# EAGLE design Memory Board (EAGLE 6.5.0)
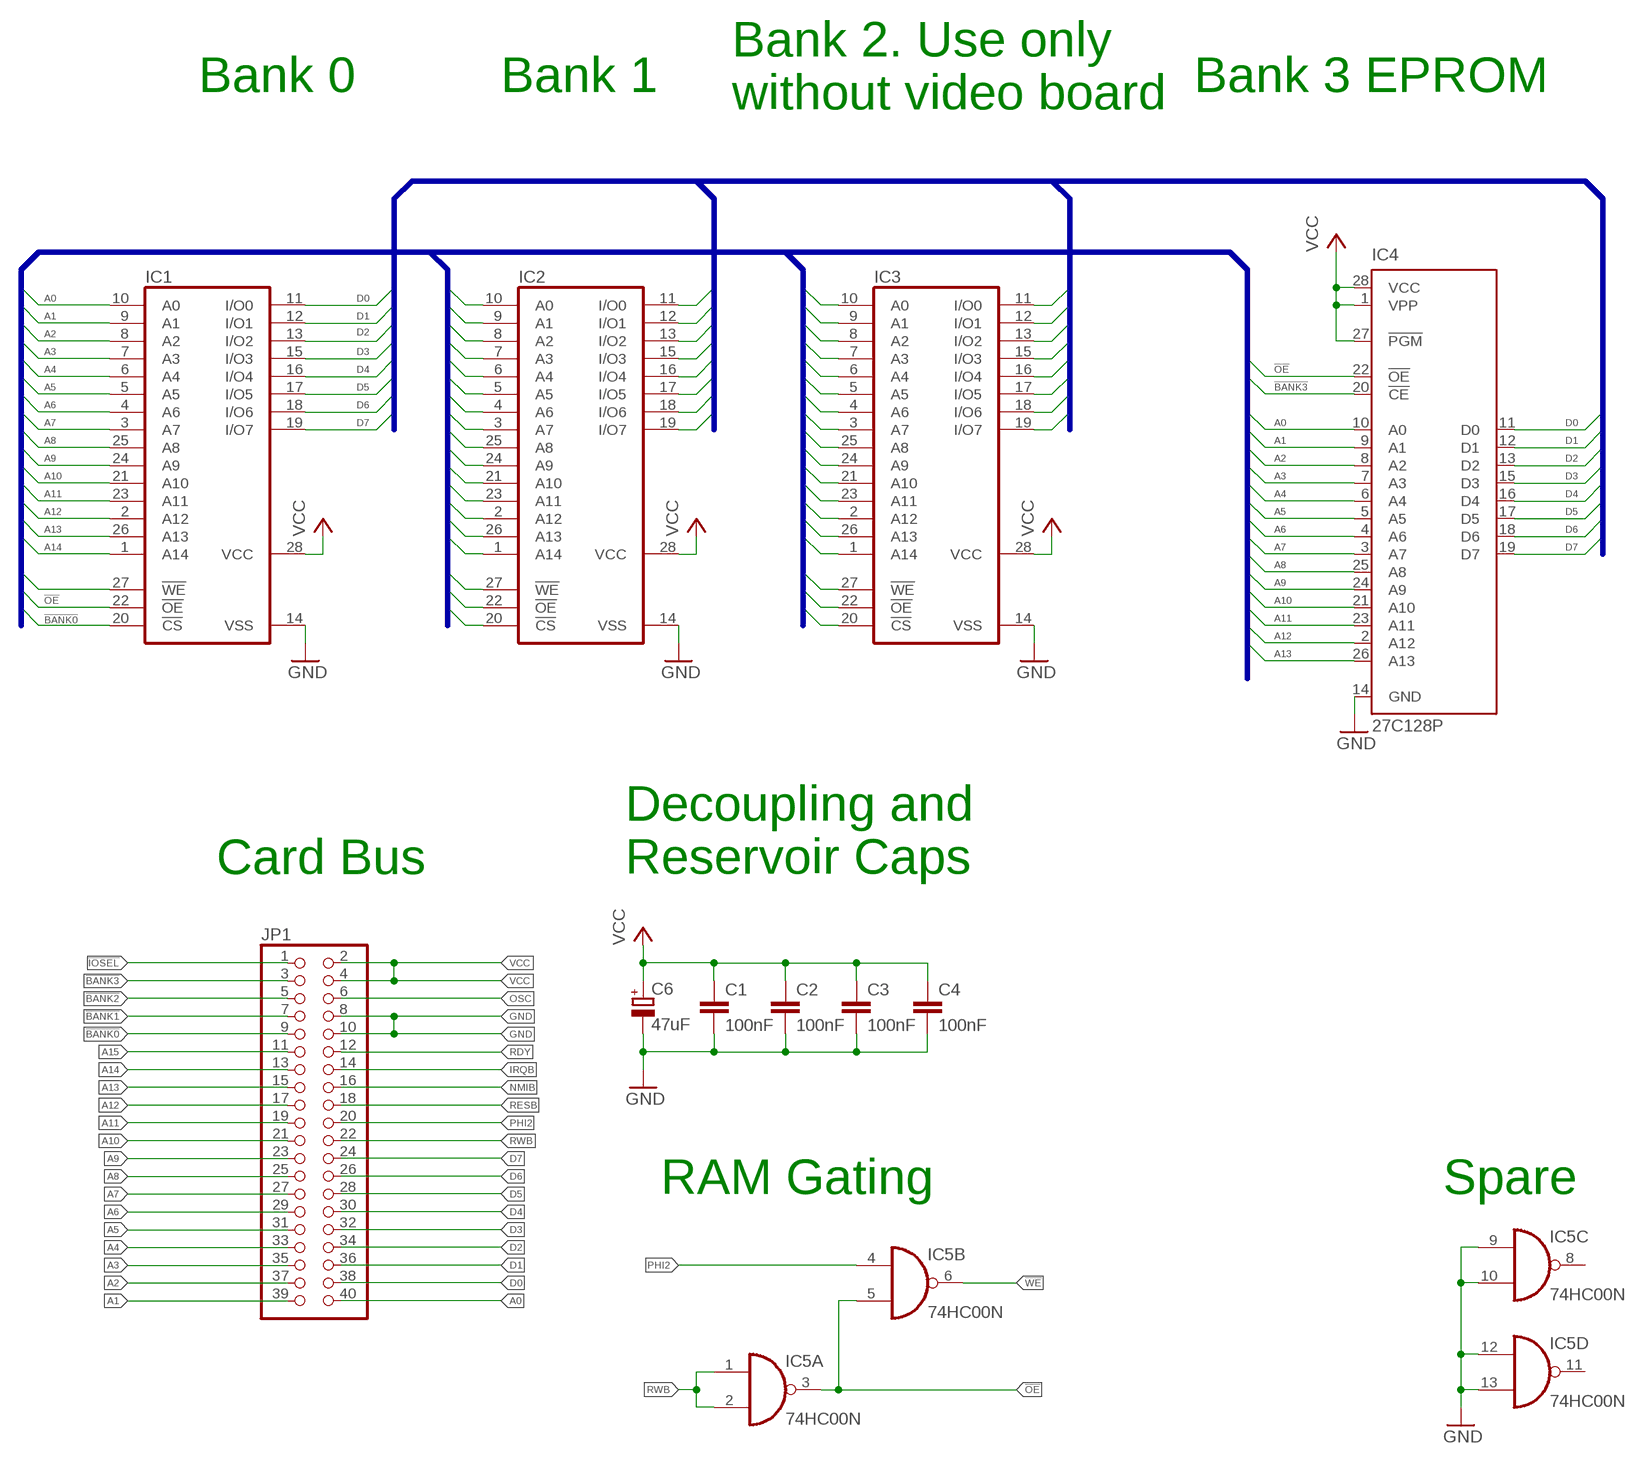
[diagram p0: schematic, sheet 1]

## Parts
C1  100nF  C-EU050-025X075  [C050-025X075]
C2  100nF  C-EU050-025X075  [C050-025X075]
C3  100nF  C-EU050-025X075  [C050-025X075]
C4  100nF  C-EU050-025X075  [C050-025X075]
C6  47uF  CPOL-EUE2.5-7  [E2,5-7]
IC1  62256P  [DIL28-6]
IC2  62256P  [DIL28-6]
IC3  62256P  [DIL28-6]
IC4  27C128P  [DIL28-6]
IC5  74HC00N  [DIL14]
JP1  PINHD-2X20/90  [2X20/90]

## Nets
!BANK0: IC1.20(!CS) JP1.9
!BANK1: IC2.20(!CS) JP1.7
!BANK2: IC3.20(!CS) JP1.5
!BANK3: IC4.20(!CE) JP1.3
!IOSEL: JP1.1
!OE: IC1.22(!OE) IC2.22(!OE) IC3.22(!OE) IC4.22(!OE) IC5.3(A:O) IC5.5(B:I1)
!WE: IC1.27(!WE) IC2.27(!WE) IC3.27(!WE) IC5.6(B:O)
A0: IC1.10(A0) IC2.10(A0) IC3.10(A0) IC4.10(A0) JP1.40
A1: IC1.9(A1) IC2.9(A1) IC3.9(A1) IC4.9(A1) JP1.39
A2: IC1.8(A2) IC2.8(A2) IC3.8(A2) IC4.8(A2) JP1.37
A3: IC1.7(A3) IC2.7(A3) IC3.7(A3) IC4.7(A3) JP1.35
A4: IC1.6(A4) IC2.6(A4) IC3.6(A4) IC4.6(A4) JP1.33
A5: IC1.5(A5) IC2.5(A5) IC3.5(A5) IC4.5(A5) JP1.31
A6: IC1.4(A6) IC2.4(A6) IC3.4(A6) IC4.4(A6) JP1.29
A7: IC1.3(A7) IC2.3(A7) IC3.3(A7) IC4.3(A7) JP1.27
A8: IC1.25(A8) IC2.25(A8) IC3.25(A8) IC4.25(A8) JP1.25
A9: IC1.24(A9) IC2.24(A9) IC3.24(A9) IC4.24(A9) JP1.23
A10: IC1.21(A10) IC2.21(A10) IC3.21(A10) IC4.21(A10) JP1.21
A11: IC1.23(A11) IC2.23(A11) IC3.23(A11) IC4.23(A11) JP1.19
A12: IC1.2(A12) IC2.2(A12) IC3.2(A12) IC4.2(A12) JP1.17
A13: IC1.26(A13) IC2.26(A13) IC3.26(A13) IC4.26(A13) JP1.15
A14: IC1.1(A14) IC2.1(A14) IC3.1(A14) JP1.13
A15: JP1.11
D0: IC1.11(I/O0) IC2.11(I/O0) IC3.11(I/O0) IC4.11(D0) JP1.38
D1: IC1.12(I/O1) IC2.12(I/O1) IC3.12(I/O1) IC4.12(D1) JP1.36
D2: IC1.13(I/O2) IC2.13(I/O2) IC3.13(I/O2) IC4.13(D2) JP1.34
D3: IC1.15(I/O3) IC2.15(I/O3) IC3.15(I/O3) IC4.15(D3) JP1.32
D4: IC1.16(I/O4) IC2.16(I/O4) IC3.16(I/O4) IC4.16(D4) JP1.30
D5: IC1.17(I/O5) IC2.17(I/O5) IC3.17(I/O5) IC4.17(D5) JP1.28
D6: IC1.18(I/O6) IC2.18(I/O6) IC3.18(I/O6) IC4.18(D6) JP1.26
D7: IC1.19(I/O7) IC2.19(I/O7) IC3.19(I/O7) IC4.19(D7) JP1.24
GND: C1.2 C2.2 C3.2 C4.2 C6.- IC1.14(VSS) IC2.14(VSS) IC3.14(VSS) IC4.14(GND) IC5.9(C:I0) IC5.10(C:I1) IC5.12(D:I0) IC5.13(D:I1) JP1.8 JP1.10
IRQB: JP1.14
NMIB: JP1.16
OSC: JP1.6
PHI2: IC5.4(B:I0) JP1.20
RDY: JP1.12
RESB: JP1.18
RWB: IC5.1(A:I0) IC5.2(A:I1) JP1.22
VCC: C1.1 C2.1 C3.1 C4.1 C6.+ IC1.28(VCC) IC2.28(VCC) IC3.28(VCC) IC4.1(VPP) IC4.27(!PGM) IC4.28(VCC) JP1.2 JP1.4
Unconnected: IC5.8(C:O) IC5.11(D:O)

## Buses
D[0..7]
A[0..15],!OE,!BANK0,!BANK1,!BANK2,!BANK3,!WE

## Notes on the sheet
- Bank 0 | Bank 1 | Bank 3 EPROM
- Bank 2. Use only
  without video board
- Card Bus
- Decoupling and
  Reservoir Caps
- RAM Gating | Spare

## Power pins joined to a net without a drawn wire
GND: IC5.7(P:GND)
VCC: IC5.14(P:VCC)

## Library data of the parts
C1-C4 = rcl:C-EU: CAPACITOR, European symbol
C6 = rcl:CPOL-EU: POLARIZED CAPACITOR, European symbol
IC1-IC3 = memory-hitachi:62256P: MEMORY; OC_FARNELL: unknown; OC_NEWARK: unknown
IC4 = microchip:27*128: CMOS EPROM 128 K (16 K x 8); OC_FARNELL: unknown; OC_NEWARK: unknown
IC5 = 74xx-eu:74*00: Quad 2-input NAND gate
JP1 = pinhead:PINHD-2X20: PIN HEADER

## Board
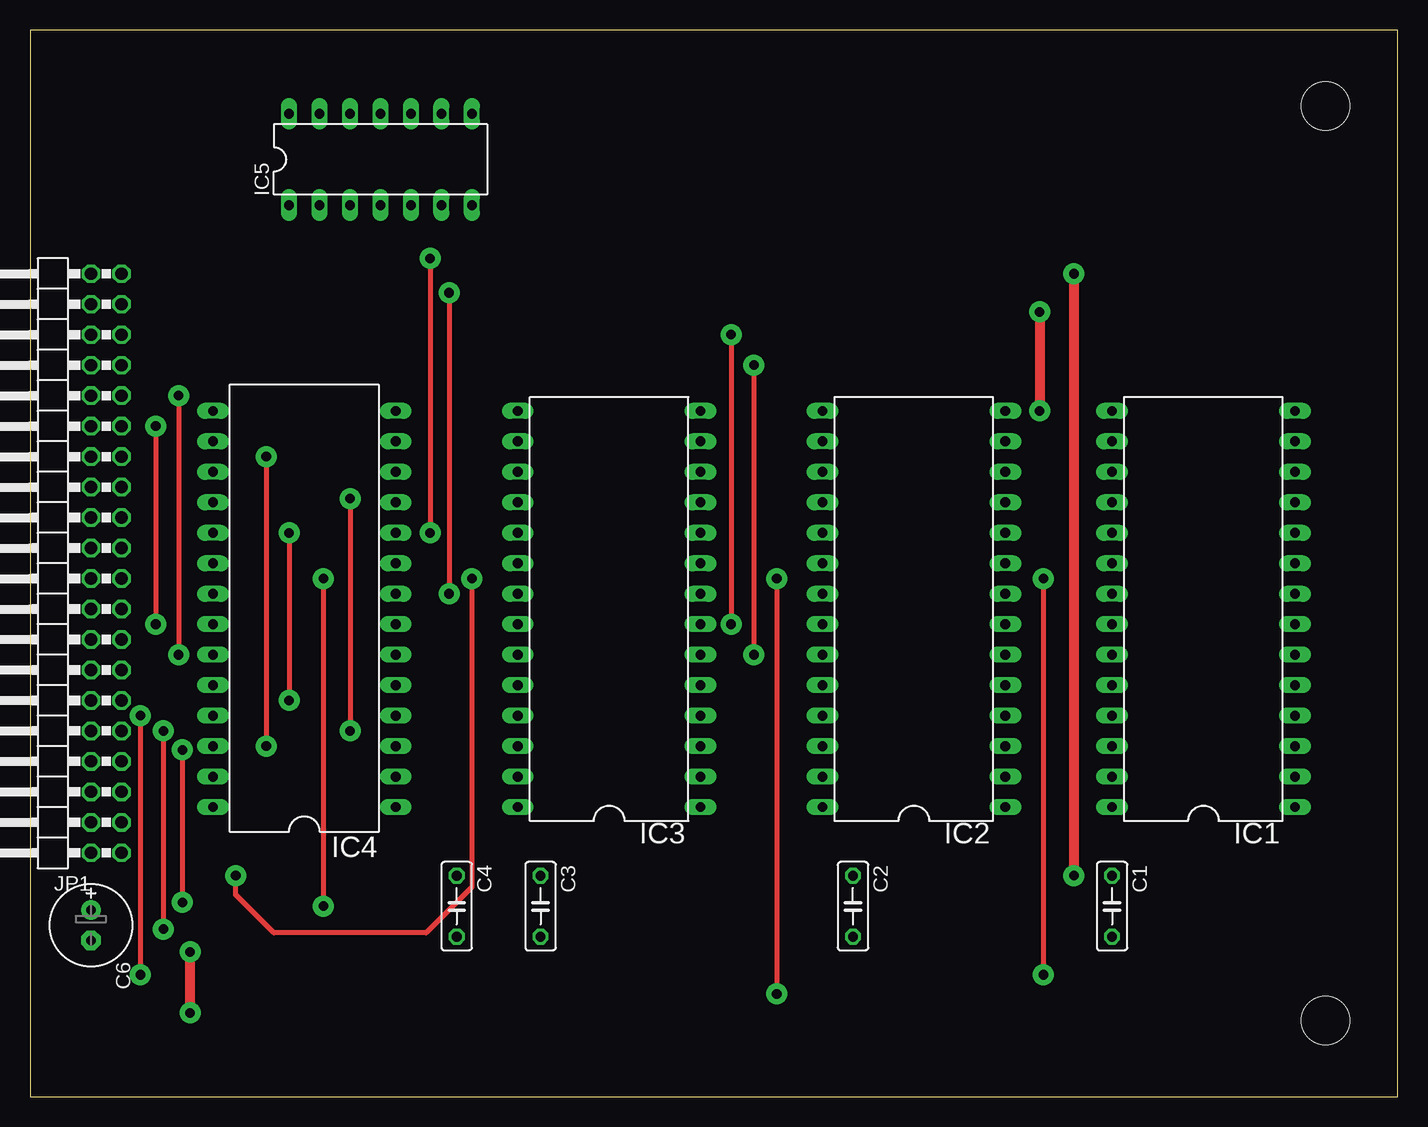
[diagram p1: board, top side]
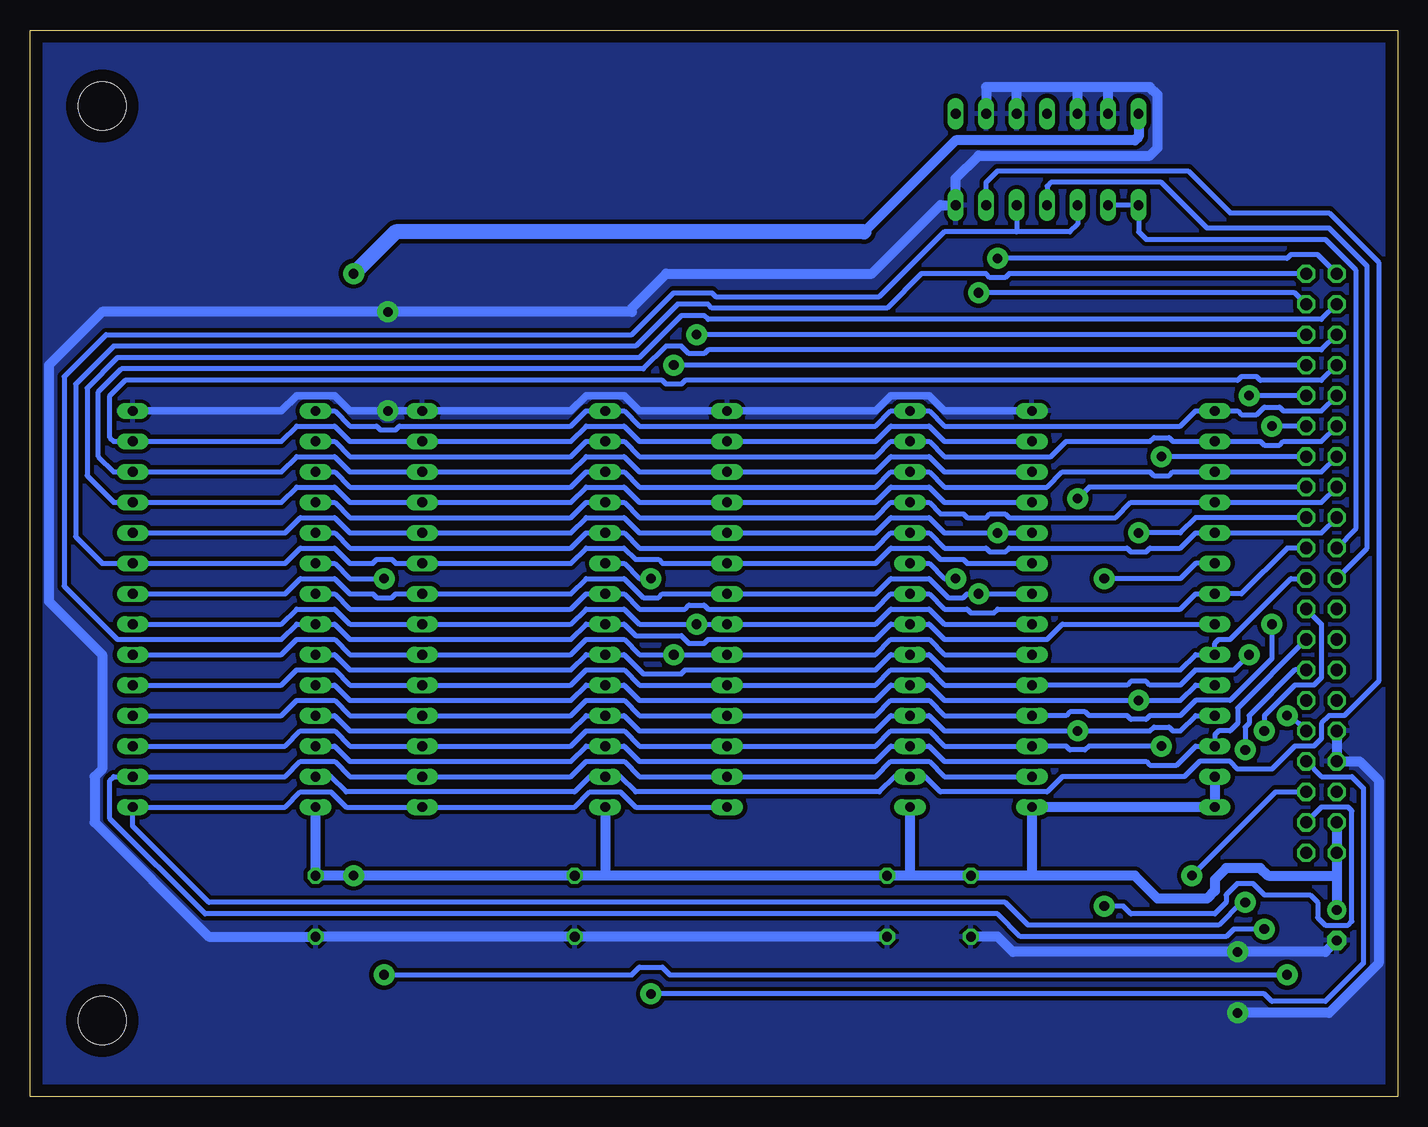
[diagram p2: board, bottom side, seen from below]

Size 113.97 x 88.89 mm. Coordinates in mm from the lower left corner, seen from the top.
Outline: 0,0 113.97,0 113.97,88.89 0,88.89 0,0
Copper layers (1*16): Top 0.035mm / dielectric 1.5mm / Bottom 0.035mm
Design rules "default *": minimum track width 10mil, minimum drill 24mil, track to track 8mil, track to pad 8mil, pad to pad 8mil, via to via 8mil, smd to smd 8mil, copper to edge 40mil, drill to drill 8mil, minimum pad ring 10mil, minimum via ring 8mil, stop-mask expansion 4mil, vias tented up to drill 0mil, thermal gap 12mil
Holes 4 mm at 107.95,82.55 107.95,6.35

### Footprints (pad centres in the part's own frame; a part is rotated, then mirrored left to right if it is on the bottom)
C050-025X075 = drill 0.813 octagon: 1 -2.54,0; 2 2.54,0
E2,5-7 = drill 0.813 pad 1.6: + -1.27,0 | drill 0.813 pad 1.6 octagon: - 1.27,0
DIL28-6 = drill 0.813 long: 1 -16.51,-7.62; 2 -13.97,-7.62; 3 -11.43,-7.62; 4 -8.89,-7.62; 5 -6.35,-7.62; 6 -3.81,-7.62; 7 -1.27,-7.62; 8 1.27,-7.62; 9 3.81,-7.62; 10 6.35,-7.62; 11 8.89,-7.62; 12 11.43,-7.62; 13 13.97,-7.62; 14 16.51,-7.62; 15 16.51,7.62; 16 13.97,7.62; 17 11.43,7.62; 18 8.89,7.62; 19 6.35,7.62; 20 3.81,7.62; 21 1.27,7.62; 22 -1.27,7.62; 23 -3.81,7.62; 24 -6.35,7.62; 25 -8.89,7.62; 26 -11.43,7.62; 27 -13.97,7.62; 28 -16.51,7.62
DIL14 = drill 0.813 long: 1 -7.62,-3.81; 2 -5.08,-3.81; 3 -2.54,-3.81; 4 0,-3.81; 5 2.54,-3.81; 6 5.08,-3.81; 7 7.62,-3.81; 8 7.62,3.81; 9 5.08,3.81; 10 2.54,3.81; 11 0,3.81; 12 -2.54,3.81; 13 -5.08,3.81; 14 -7.62,3.81
2X20/90 = drill 1.016 octagon: 1 -24.13,-6.35; 2 -24.13,-3.81; 3 -21.59,-6.35; 4 -21.59,-3.81; 5 -19.05,-6.35; 6 -19.05,-3.81; 7 -16.51,-6.35; 8 -16.51,-3.81; 9 -13.97,-6.35; 10 -13.97,-3.81; 11 -11.43,-6.35; 12 -11.43,-3.81; 13 -8.89,-6.35; 14 -8.89,-3.81; 15 -6.35,-6.35; 16 -6.35,-3.81; 17 -3.81,-6.35; 18 -3.81,-3.81; 19 -1.27,-6.35; 20 -1.27,-3.81; 21 1.27,-6.35; 22 1.27,-3.81; 23 3.81,-6.35; 24 3.81,-3.81; 25 6.35,-6.35; 26 6.35,-3.81; 27 8.89,-6.35; 28 8.89,-3.81; 29 11.43,-6.35; 30 11.43,-3.81; 31 13.97,-6.35; 32 13.97,-3.81; 33 16.51,-6.35; 34 16.51,-3.81; 35 19.05,-6.35; 36 19.05,-3.81; 37 21.59,-6.35; 38 21.59,-3.81; 39 24.13,-6.35; 40 24.13,-3.81

### Placement (x,y rotation side)
C1  90.17,15.88 270 top
C2  68.58,15.88 270 top
C3  42.55,15.88 270 top
C4  35.56,15.88 270 top
C6  5.08,14.29 270 top
IC1  97.79,40.64 90 top
IC2  73.66,40.64 90 top
IC3  48.26,40.64 90 top
IC4  22.86,40.64 90 top
IC5  29.21,78.11 0 top
JP1  1.27,44.45 90 top

### Tracks (layer width: path | path; a pad name or v marks a point on that pad's centre or on a via)
!BANK0  (via drill 0.8 pad 1.75)
  Top 0.406: v9.21,31.75 v9.21,10.16 | v84.45,43.18 v84.45,10.16
  Bottom 0.406: JP1.9 8.26,31.11 v9.21,31.75 | IC1.20 88.58,44.45 87.31,43.18 v84.45,43.18 | v84.45,10.16 63.82,10.16 63.18,10.79 61.28,10.79 60.64,10.16 v9.21,10.16
!BANK1  (via drill 0.8 pad 1.75)
  Top 0.406: v62.23,43.18 v62.23,8.57
  Bottom 0.406: IC2.20 64.45,44.45 63.18,43.18 v62.23,43.18 | JP1.7 6.35,26.67 3.81,26.67 2.86,25.72 2.86,11.11 6.03,7.94 10.48,7.94 11.11,8.57 v62.23,8.57
!BANK2  (via drill 0.8 pad 1.75)
  Top 0.406: v36.83,43.18 36.83,17.46 33.02,13.65 20.32,13.65 17.14,16.83 v17.14,18.41
  Bottom 0.406: v36.83,43.18 37.78,43.18 39.05,44.45 IC3.20 | v17.14,18.41 10.16,25.4 JP1.5
!BANK3  (via drill 0.8 pad 1.75)
  Top 0.406: v24.45,43.18 v24.45,15.88
  Bottom 0.406: IC4.20 16.83,44.45 18.1,43.18 v24.45,43.18 | JP1.3 6.35,24.13 4.13,24.13 3.81,23.81 3.81,14.61 4.13,14.29 6.03,14.29 6.67,14.92 6.67,16.19 7.3,16.83 11.11,16.83 12.06,17.78 13.34,17.78 14.29,16.83 14.29,16.19 15.24,15.24 22.23,15.24 22.86,15.88 v24.45,15.88
!OE
  Bottom 0.406: IC4.22 27.94,39.37 29.21,38.1 37.78,38.1 39.05,39.37 IC3.22 42.23,39.37 43.5,38.1 57.47,38.1 57.78,37.78 59.05,37.78 59.69,38.42 63.5,38.42 64.45,39.37 IC2.22 67.63,39.37 68.9,38.1 87.31,38.1 88.58,39.37 IC1.22 91.76,39.37 93.03,38.1 106.68,38.1 111.12,42.55 111.12,60.01 107.63,63.5 63.82,63.5 60.33,66.99 57.15,66.99 56.83,66.67 43.18,66.67 37.78,72.07 31.75,72.07 | IC5.3 26.67,72.71 27.3,72.07 31.75,72.07 | IC5.5 31.75,72.07
!WE
  Bottom 0.406: IC1.27 88.9,26.67 87.63,25.4 68.58,25.4 67.31,26.67 IC2.27 64.77,26.67 63.5,25.4 43.18,25.4 41.91,26.67 IC3.27 39.37,26.67 38.1,25.4 29.21,25.4 27.94,26.67 17.78,26.67 16.51,27.94 13.97,27.94 13.34,27.3 10.48,27.3 8.57,29.21 6.99,29.21 6.35,29.84 6.35,31.11 5.71,31.75 4.45,31.75 1.59,34.61 1.59,69.53 5.71,73.66 13.97,73.66 17.46,77.15 33.34,77.15 34.29,76.2 IC5.6
A0  (via drill 0.8 pad 1.75)
  Top 0.406: v33.34,69.85 v33.34,46.99
  Bottom 0.406: IC1.10 92.71,46.99 91.44,48.26 88.58,48.26 87.31,46.99 IC2.10 68.9,46.99 67.63,48.26 64.45,48.26 63.18,46.99 IC3.10 43.5,46.99 42.23,48.26 39.05,48.26 37.78,46.99 v33.34,46.99 IC4.10 | JP1.40 6.67,70.17 8.89,70.17 9.21,69.85 v33.34,69.85
A1
  Bottom 0.406: IC4.9 35.88,44.45 36.2,44.77 38.1,44.77 39.05,45.72 42.23,45.72 43.5,44.45 IC3.9 61.28,44.45 61.59,44.77 63.5,44.77 64.45,45.72 67.63,45.72 68.9,44.45 IC2.9 83.5,44.45 83.82,44.77 85.09,44.77 85.41,44.45 87.31,44.45 88.58,45.72 91.44,45.72 92.71,44.45 IC1.9 107.95,44.45 110.17,46.67 110.17,59.37 107,62.55 63.5,62.55 60.01,66.04 57.47,66.04 57.15,65.72 42.55,65.72 39.69,68.58 34.29,68.58 33.97,68.26 32.7,68.26 32.38,68.58 JP1.39
A2  (via drill 0.8 pad 1.75)
  Top 0.406: v34.92,66.99 v34.92,41.91
  Bottom 0.406: IC1.8 92.71,41.91 91.44,43.18 88.58,43.18 87.31,41.91 85.41,41.91 85.09,41.59 83.82,41.59 83.5,41.91 IC2.8 68.9,41.91 67.63,43.18 64.45,43.18 62.87,41.59 61.59,41.59 61.28,41.91 IC3.8 43.5,41.91 42.23,43.18 39.05,43.18 37.47,41.59 36.2,41.59 35.88,41.91 v34.92,41.91 IC4.8 | JP1.37 8.57,66.99 v34.92,66.99
A3  (via drill 0.8 pad 1.75)
  Top 0.406: v58.42,63.5 v58.42,39.37
  Bottom 0.406: IC1.7 93.03,39.37 91.76,40.64 88.58,40.64 87.31,39.37 IC2.7 68.9,39.37 67.63,40.64 64.45,40.64 63.18,39.37 v58.42,39.37 IC3.7 43.5,39.37 42.23,40.64 39.05,40.64 37.78,39.37 IC4.7 | JP1.35 v58.42,63.5
A4  (via drill 0.8 pad 1.75)
  Top 0.406: v60.33,60.96 v60.33,36.83
  Bottom 0.406: IC1.6 93.03,36.83 91.76,38.1 88.58,38.1 87.31,36.83 IC2.6 68.9,36.83 67.63,38.1 64.45,38.1 63.18,36.83 v60.33,36.83 IC3.6 43.5,36.83 42.23,38.1 39.05,38.1 37.78,36.83 IC4.6 | JP1.33 v60.33,60.96
A5  (via drill 0.8 pad 1.75)
  Top 0.406: v12.38,58.42 v12.38,36.83
  Bottom 0.406: IC1.5 93.03,34.29 91.76,35.56 88.58,35.56 87.31,34.29 IC2.5 68.9,34.29 67.63,35.56 64.45,35.56 63.18,34.29 IC3.5 43.5,34.29 42.23,35.56 39.05,35.56 37.78,34.29 IC4.5 22.54,34.29 22.23,34.61 20.95,34.61 20.64,34.29 18.1,34.29 16.83,35.56 13.65,35.56 v12.38,36.83 | JP1.31 v12.38,58.42
A6  (via drill 0.8 pad 1.75)
  Top 0.406: v10.48,55.88 v10.48,39.37
  Bottom 0.406: IC1.4 93.03,31.75 91.76,33.02 88.58,33.02 87.31,31.75 IC2.4 68.9,31.75 67.63,33.02 64.45,33.02 63.18,31.75 IC3.4 43.5,31.75 42.23,33.02 39.05,33.02 37.78,31.75 IC4.4 27.62,31.75 27.3,32.07 26.04,32.07 25.72,31.75 22.54,31.75 22.23,31.43 20.95,31.43 20.64,31.75 18.1,31.75 16.83,33.02 13.97,33.02 10.48,36.51 v10.48,39.37 | JP1.29 v10.48,55.88
A7  (via drill 0.8 pad 1.75)
  Top 0.406: v19.68,53.34 v19.68,29.21
  Bottom 0.406: IC1.3 92.71,29.21 91.44,30.48 88.58,30.48 87.31,29.21 IC2.3 68.9,29.21 67.63,30.48 64.45,30.48 63.18,29.21 IC3.3 43.5,29.21 42.23,30.48 39.05,30.48 37.78,29.21 IC4.3 27.62,29.21 27.3,28.89 26.04,28.89 25.72,29.21 v19.68,29.21 | JP1.27 v19.68,53.34
A8  (via drill 0.8 pad 1.75)
  Top 0.406: v26.67,49.85 v26.67,30.48
  Bottom 0.406: IC1.25 88.58,31.75 87.31,30.48 68.9,30.48 67.63,31.75 IC2.25 64.45,31.75 63.18,30.48 43.5,30.48 42.23,31.75 IC3.25 39.05,31.75 37.78,30.48 v26.67,30.48 20.64,30.48 20.32,30.8 19.05,30.8 18.73,30.48 18.1,30.48 16.83,31.75 IC4.25 | JP1.25 25.72,50.8 v26.67,49.85
A9  (via drill 0.8 pad 1.75)
  Top 0.406: v21.59,46.99 v21.59,33.02
  Bottom 0.406: IC1.24 88.58,34.29 87.31,33.02 68.9,33.02 67.63,34.29 IC2.24 64.45,34.29 63.18,33.02 43.5,33.02 42.23,34.29 IC3.24 39.05,34.29 37.78,33.02 v21.59,33.02 18.1,33.02 16.83,34.29 IC4.24 | JP1.23 16.83,48.26 18.1,46.99 v21.59,46.99
A10
  Bottom 0.406: IC1.21 88.58,41.91 87.31,40.64 68.9,40.64 67.63,41.91 IC2.21 64.45,41.91 63.18,40.64 59.37,40.64 59.05,40.96 57.78,40.96 57.47,40.64 43.5,40.64 42.23,41.91 IC3.21 39.05,41.91 37.78,40.64 35.88,40.64 35.56,40.32 33.66,40.32 33.34,40.64 18.1,40.64 16.83,41.91 IC4.21 13.02,41.91 9.21,45.72 JP1.21
A11
  Bottom 0.406: IC1.23 88.58,36.83 87.31,35.56 68.9,35.56 67.63,36.83 IC2.23 64.45,36.83 62.87,35.24 59.69,35.24 59.37,35.56 43.5,35.56 42.23,36.83 IC3.23 39.05,36.83 37.78,35.56 18.1,35.56 16.83,36.83 IC4.23 15.24,37.78 14.92,38.1 13.97,38.1 8.89,43.18 JP1.19
A12  (via drill 0.8 pad 1.75)
  Top 0.406: v11.11,30.48 v11.11,13.97
  Bottom 0.406: IC4.2 37.78,26.67 39.05,27.94 42.23,27.94 43.5,26.67 IC3.2 63.18,26.67 64.45,27.94 67.63,27.94 68.9,26.67 IC2.2 87.31,26.67 88.58,27.94 91.44,27.94 92.71,26.67 IC1.2 107,26.67 107.31,26.35 107.31,23.18 99.38,15.24 33.34,15.24 31.43,13.34 14.29,13.34 13.65,13.97 v11.11,13.97 | JP1.17 6.35,39.37 6.35,34.92 6.99,34.29 8.57,34.29 11.11,31.75 v11.11,30.48
A13
  Bottom 0.406: IC1.26 88.58,29.21 87.31,27.94 68.9,27.94 67.63,29.21 IC2.26 64.45,29.21 63.18,27.94 43.5,27.94 42.23,29.21 IC3.26 39.05,29.21 37.78,27.94 20.95,27.94 20.64,27.62 18.41,27.62 16.83,29.21 IC4.26 15.24,30.16 14.92,30.48 13.97,30.48 13.34,31.11 13.34,32.38 JP1.15
A14  (via drill 0.8 pad 1.75)
  Top 0.406: v12.7,28.89 v12.7,16.19
  Bottom 0.406: IC3.1 63.5,24.13 64.77,25.4 67.31,25.4 68.58,24.13 IC2.1 87.63,24.13 88.9,25.4 91.44,25.4 92.71,24.13 IC1.1 105.41,22.54 99.06,16.19 32.7,16.19 30.8,14.29 14.92,14.29 13.02,16.19 v12.7,16.19 | JP1.13 8.57,35.56 12.38,31.75 12.38,31.11 12.7,30.8 v12.7,28.89
D0
  Bottom 0.406: IC4.11 37.78,49.53 39.05,50.8 42.23,50.8 43.5,49.53 IC3.11 63.18,49.53 64.45,50.8 67.63,50.8 68.9,49.53 IC2.11 87.31,49.53 88.58,50.8 91.76,50.8 93.03,49.53 IC1.11 107,49.53 109.22,51.75 109.22,59.05 106.68,61.59 63.18,61.59 59.69,65.09 57.78,65.09 57.47,64.77 6.35,64.77 JP1.38
D1
  Bottom 0.406: IC4.12 37.78,52.07 39.05,53.34 42.23,53.34 43.5,52.07 IC3.12 63.18,52.07 64.45,53.34 67.63,53.34 68.9,52.07 IC2.12 87.31,52.07 88.58,53.34 91.76,53.34 93.03,52.07 IC1.12 107,52.07 108.27,53.34 108.27,58.74 106.36,60.64 62.87,60.64 60.96,62.55 59.69,62.55 59.05,61.91 57.78,61.91 57.47,62.23 6.35,62.23 JP1.36
D2
  Bottom 0.406: IC4.13 37.78,54.61 39.05,55.88 42.23,55.88 43.5,54.61 IC3.13 63.18,54.61 64.45,55.88 67.63,55.88 68.9,54.61 IC2.13 87.31,54.61 88.58,55.88 91.76,55.88 93.03,54.61 IC1.13 107,54.61 107.31,54.93 107.31,58.42 106.05,59.69 61.28,59.69 60.96,59.37 59.69,59.37 59.37,59.69 13.34,59.69 13.02,60.01 11.75,60.01 11.43,59.69 6.35,59.69 JP1.34
D3
  Bottom 0.406: IC1.15 88.58,57.15 87.31,55.88 85.09,55.88 84.77,55.56 83.5,55.56 83.19,55.88 68.9,55.88 67.63,57.15 IC2.15 64.45,57.15 63.18,55.88 43.5,55.88 42.23,57.15 IC3.15 39.05,57.15 37.78,55.88 18.1,55.88 16.83,57.15 IC4.15 13.34,57.15 13.02,56.83 11.75,56.83 11.11,57.47 9.84,57.47 9.53,57.15 6.35,57.15 JP1.32
D4
  Bottom 0.406: IC1.16 88.58,54.61 87.31,53.34 68.9,53.34 67.63,54.61 IC2.16 64.45,54.61 63.18,53.34 43.5,53.34 42.23,54.61 IC3.16 39.05,54.61 37.78,53.34 28.89,53.34 27.62,54.61 20.64,54.61 20.32,54.93 19.05,54.93 18.73,54.61 IC4.16 11.43,54.61 11.11,54.29 9.84,54.29 9.53,54.61 6.35,54.61 JP1.30
D5
  Bottom 0.406: IC1.17 88.58,52.07 87.31,50.8 68.9,50.8 67.63,52.07 IC2.17 64.45,52.07 63.18,50.8 43.5,50.8 42.23,52.07 IC3.17 39.05,52.07 37.78,50.8 29.21,50.8 27.94,52.07 20.64,52.07 20.32,51.75 19.05,51.75 18.73,52.07 IC4.17 6.35,52.07 JP1.28
D6
  Bottom 0.406: IC1.18 88.58,49.53 87.31,48.26 68.9,48.26 67.63,49.53 IC2.18 64.45,49.53 63.18,48.26 43.5,48.26 42.23,49.53 IC3.18 39.05,49.53 38.1,48.58 36.2,48.58 35.88,48.26 34.29,48.26 33.97,48.58 32.7,48.58 32.38,48.26 23.5,48.26 22.23,49.53 IC4.18 6.35,49.53 JP1.26
D7
  Bottom 0.406: IC1.19 88.58,46.99 87.31,45.72 68.9,45.72 67.63,46.99 IC2.19 64.45,46.99 63.18,45.72 43.5,45.72 42.23,46.99 IC3.19 39.05,46.99 37.78,45.72 34.29,45.72 33.97,45.4 32.7,45.4 32.38,45.72 22.54,45.72 22.23,45.4 20.95,45.4 20.64,45.72 18.1,45.72 16.83,46.99 IC4.19 6.35,46.99 JP1.24
GND  (via drill 0.8 pad 1.75)
  Top 0.813: v84.14,65.41 v84.14,57.15 | v13.34,6.99 v13.34,12.06
  Bottom 0.61: IC1.14 93.03,57.15 91.76,58.42 88.58,58.42 87.31,57.15 v84.14,57.15 IC2.14 68.9,57.15 67.63,58.42 64.45,58.42 63.18,57.15 IC3.14 43.5,57.15 42.23,58.42 39.05,58.42 37.78,57.15 IC4.14
  Bottom 0.813: JP1.10 JP1.8 3.17,27.94 1.59,26.35 1.59,11.11 5.71,6.99 v13.34,6.99 | C6.- 6.03,12.06 v13.34,12.06 32.07,12.06 33.34,13.34 C4.2 | C3.2 C2.2 C1.2 99.06,13.34 108.58,22.86 108.58,26.67 107.95,27.3 107.95,36.83 112.39,41.27 112.39,60.96 107.95,65.41 v84.14,65.41 63.82,65.41 63.82,65.72 60.96,68.58 43.81,68.58 38.1,74.3 IC5.7 36.83,76.52 34.92,78.42 20.64,78.42 20,79.06 20,83.5 20.64,84.14 24.13,84.14 | 24.13,84.14 26.67,84.14 | 26.67,84.14 31.75,84.14 | 31.75,84.14 34.29,84.14 IC5.9 | IC5.10 31.75,84.14 | IC5.12 26.67,84.14 | IC5.13 24.13,84.14
  pour Bottom (isolate 0.356): 0,88.9 114.3,88.9 114.3,0 0,0
PHI2
  Bottom 0.406: JP1.20 2.54,45.72 2.54,69.22 5.71,72.39 15.88,72.39 19.68,76.2 28.89,76.2 29.21,75.88 IC5.4
RWB
  Bottom 0.406: IC5.2 IC5.1 21.59,72.07 20.95,71.44 6.03,71.44 3.49,68.9 3.49,47.31 JP1.22
VCC  (via drill 0.8 pad 1.75)
  Top 0.813: v87,68.58 v87,18.41
  Bottom 0.813: 30.48,18.41 21.91,18.41 20,16.51 15.88,16.51 15.24,17.14 15.24,18.1 14.29,19.05 11.43,19.05 10.79,18.41 5.08,18.41 | 30.48,18.41 C4.1 40.64,18.41 | 40.64,18.41 C3.1 66.04,18.41 | IC2.28 66.04,18.41 | JP1.4 JP1.2 5.08,18.41 | 5.08,18.41 C6.+ | 66.04,18.41 C2.1 v87,18.41 C1.1 IC1.28 | IC4.27 IC4.28 IC4.1 30.48,18.41 | IC3.28 40.64,18.41 | IC5.14 21.59,80.01 21.91,79.69 36.83,79.69 44.45,72.07
  Bottom 1.27: 44.45,72.07 83.5,72.07 v87,68.58